# Altium schematic sheet main.SchDoc
size A4
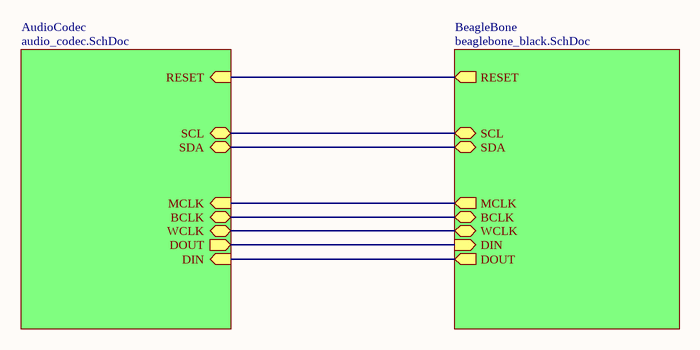
[diagram p0: main.SchDoc]

## Sub-sheets
AudioCodec = audio_codec.SchDoc: RESET (in), SCL (bidir), SDA (bidir), MCLK (in), BCLK (bidir), DIN (in), DOUT (out), WCLK (bidir)
BeagleBone = beaglebone_black.SchDoc: RESET (out), MCLK (out), SCL (bidir), SDA (bidir), BCLK (bidir), DIN (in), DOUT (out), WCLK (bidir)

## Nets
(unnamed): sheet BeagleBone/RESET, sheet AudioCodec/RESET
(unnamed): sheet BeagleBone/MCLK, sheet AudioCodec/MCLK
(unnamed): sheet BeagleBone/SCL, sheet AudioCodec/SCL
(unnamed): sheet BeagleBone/SDA, sheet AudioCodec/SDA
(unnamed): sheet BeagleBone/BCLK, sheet AudioCodec/BCLK
(unnamed): sheet BeagleBone/DIN, sheet AudioCodec/DOUT
(unnamed): sheet BeagleBone/DOUT, sheet AudioCodec/DIN
(unnamed): sheet BeagleBone/WCLK, sheet AudioCodec/WCLK